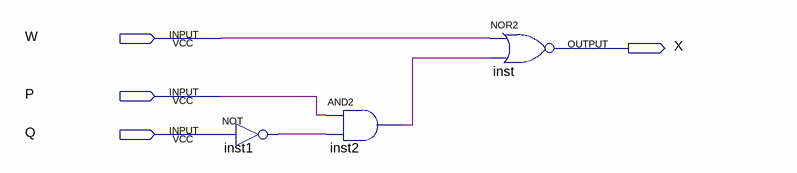
[diagram p0: schematic sheet]
// Quartus schematic LetraD.bdf as structural Verilog: 3 symbols, 4 pins
module LetraD (
  input  W,
  input  P,
  input  Q,
  output X
);

  wire inst1_out, inst2_out;

  not inst1 (inst1_out, Q);
  and inst2 (inst2_out, P, inst1_out);
  nor inst (X, W, inst2_out);
endmodule
